# Altium schematic sheet connecteur_principal.SchDoc
size A4; SheetNumber: 12; SheetTotal: 12
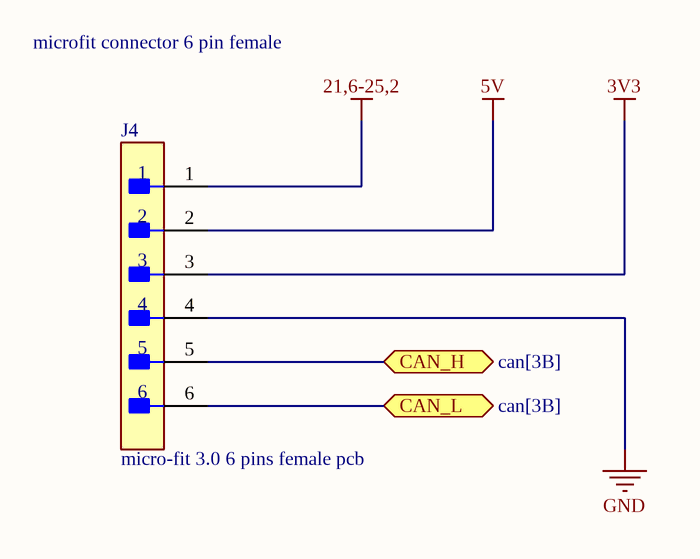
[diagram p0: connecteur_principal.SchDoc]

## Parts
J4  micro-fit 3.0 6 pins female pcb  [FP-0430450600-MFG]

## Ports
CAN_H (bidir, see can[3B]), CAN_L (bidir, see can[3B])

## Nets
3V3: J4.3
5V: J4.2
21,6-25,2: J4.1
GND: J4.4
CAN_H: J4.5 ; port CAN_H
CAN_L: J4.6 ; port CAN_L

## Notes on the sheet
- microfit connector 6 pin female

## Library data of the parts
J4 = 430450600: Connector Wire to Board Header 6 Position 3mm Solder Right Angle Thru-Hole Tray; Manufacturer: Molex; Manufacturer Part Number: 43045-0600; Plating: 154ConductorMaterial; Contact Resistance: 10mR; Voltage Rating: 250V; Current Rating: 5A; Max Voltage Rating (DC): 250.25kV; Gender: Male; Number of Positions: 6; Insulation Resistance: 1GR; Approvals: UL,CSA,TUV; Glow Wire Compliant: 15Compliance; Supplier: Digikey; Supplier Part Number: WM1815-ND; RoHS: Yes; Category: Headers and Wire Housings; Stock: 3053; Pricing: 1=2.2, 10=1.875, 80=1.54863, 1728=1.18185, 5184=1.08404 (USD); Mounting Technology: Through Hole; Case/Package: SMC; Contact Material: Brass,Tin; Contact Plating: Tin; Housing Color: Black; Housing Material: Thermoplastic; Color: Black; Material: 4301ConductorMaterial; Min Operating Temperature: -40°C; Max Operating Temperature: 105°C; Number of Rows: 2; Packaging: Tray; Termination: Solder; Orientation: Right Angle; Package Quantity: 1728; Max Current Rating: 5A; Number of Circuits: 6; Number of Contacts: 6; Series: 43045; Voltage Rating (DC): 250V; Diameter: 3mm; Length: 13.15mm; Height: 8.77mm; Pitch: 3mm; Depth: 12.2mm; Row Spacing: 3mm; Radiation Hardening: No; Flammability Rating: UL94 V-0; RoHS Compliant: Yes; Reach SVHC Compliant: Unknown; Halogen Free: 5696HalogenFree; Lead Free: 5697LeadFree; Parameter 1: *